# EAGLE schematic madaq_filter_panel_JAV (EAGLE 7.2.0)
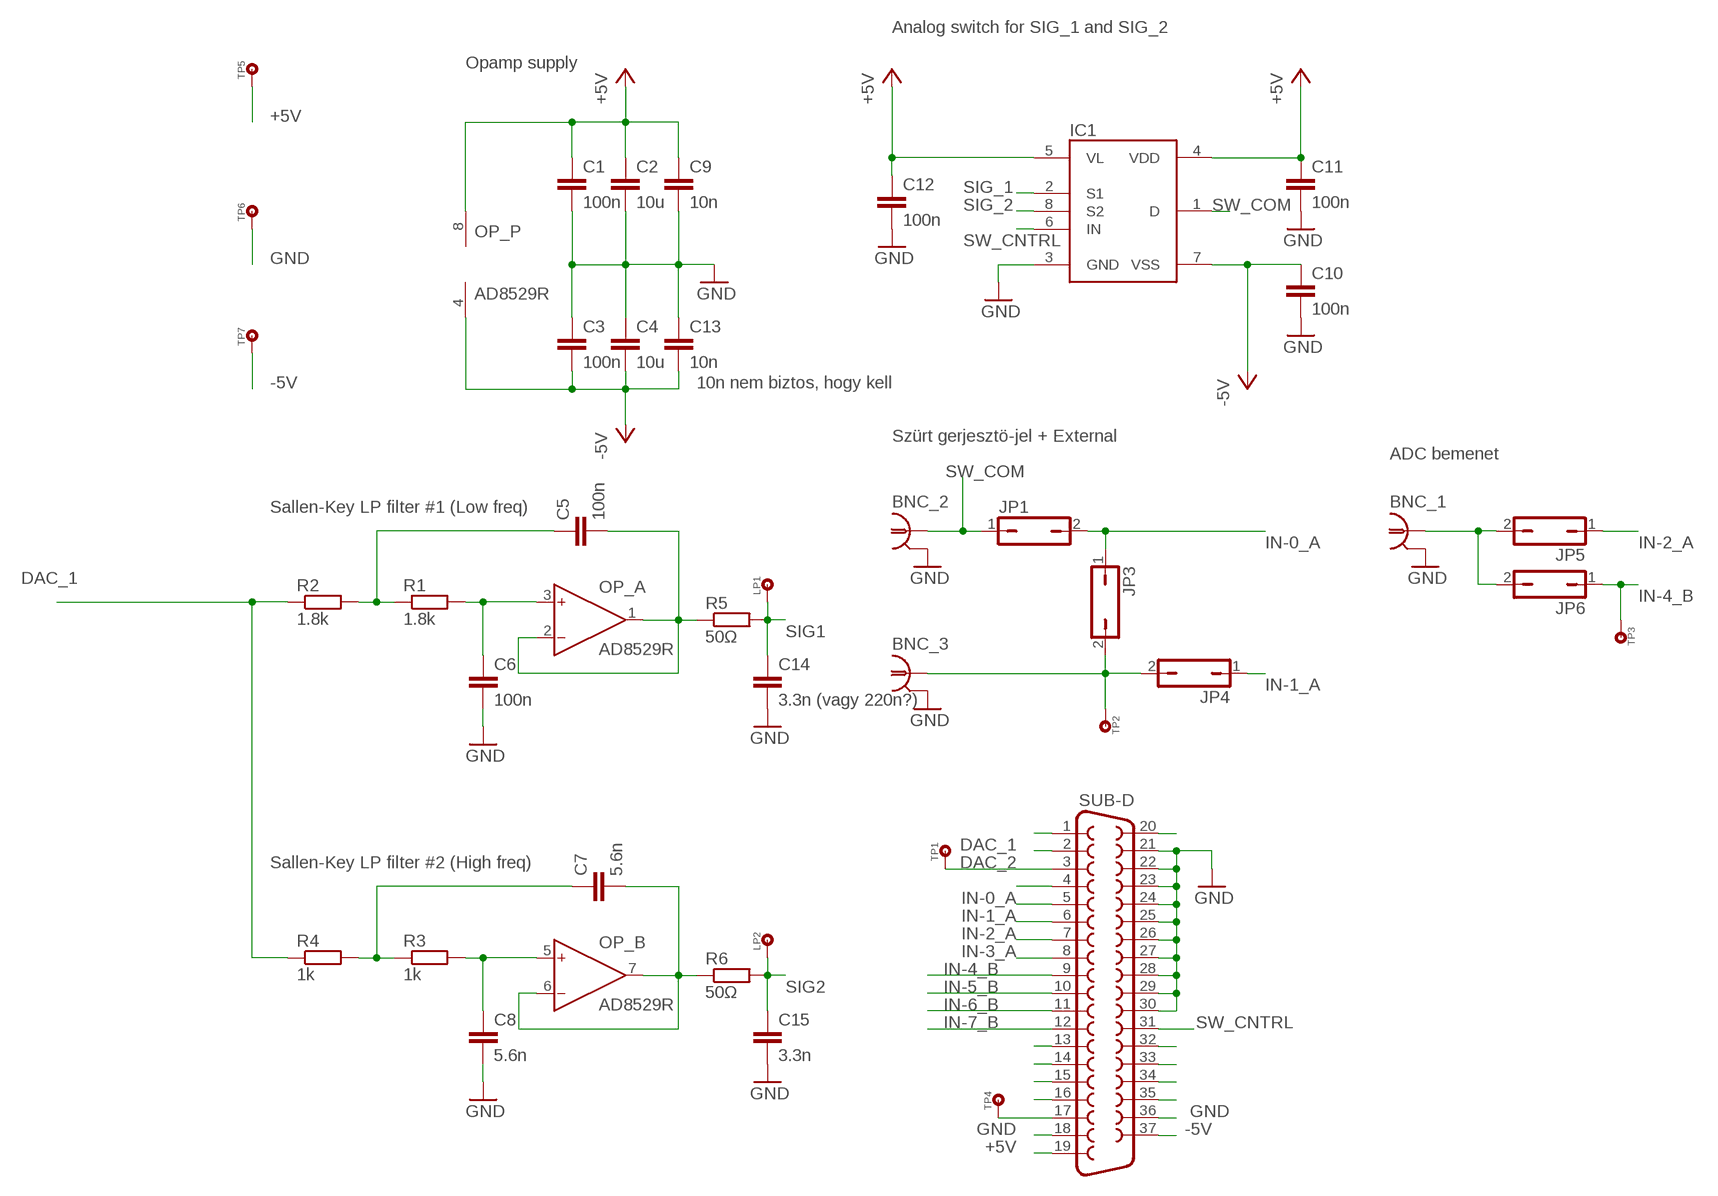
[diagram p0: schematic, sheet 1]

## Parts
BNC_1  BNC-ISOL-90I  [BNCPCB90I]
BNC_2  BNC-ISOL-90I  [BNCPCB90I]
BNC_3  BNC-ISOL-90I  [BNCPCB90I]
C1  100n  C1206  [C1206]
C2  10u  C1206  [C1206]
C3  100n  C1206  [C1206]
C4  10u  C1206  [C1206]
C5  100n  C1206  [C1206]
C6  100n  C1206  [C1206]
C7  5.6n  C1206  [C1206]
C8  5.6n  C1206  [C1206]
C9  10n  C1206  [C1206]
C10  100n  C1206  [C1206]
C11  100n  C1206  [C1206]
C12  100n  C1206  [C1206]
C13  10n  C1206  [C1206]
C14  3.3n (vagy 220n?)  C1206  [C1206]
C15  3.3n  C1206  [C1206]
IC1  ADG419BR  [SO08]
JP1  JP1Q  [JP1]
JP3  JP1Q  [JP1]
JP4  JP1Q  [JP1]
JP5  JP1Q  [JP1]
JP6  JP1Q  [JP1]
LP1  TP  [JP1]
LP2  TP  [JP1]
OP_  AD8529R  [SO8]
R1  1.8k  R1206  [R1206]
R2  1.8k  R1206  [R1206]
R3  1k  R1206  [R1206]
R4  1k  R1206  [R1206]
R5  50Ω  R1206  [R1206]
R6  50Ω  R1206  [R1206]
SUB-D  F37HP  [F37HP]
TP1  TP  [JP1]
TP2  TP  [JP1]
TP3  TP  [JP1]
TP4  TP  [JP1]
TP5  TP  [JP1]
TP6  TP  [JP1]
TP7  TP  [JP1]

## Nets
+5V: C1.2 C2.2 C9.2 C11.2 C12.2 IC1.4(VDD) IC1.5(VL) OP_.8(P:V+) SUB-D.19 TP5.1
-5V: C3.1 C4.1 C10.2 C13.1 IC1.7(VSS) OP_.4(P:V-) SUB-D.37 TP7.1
DAC_1: R2.1 R4.1 SUB-D.2
DAC_2: SUB-D.3 TP1.1
GND: BNC_1.SHIELD BNC_2.SHIELD BNC_3.SHIELD C1.1 C2.1 C3.2 C4.2 C6.1 C8.1 C9.1 C10.1 C11.1 C12.1 C13.2 C14.1 C15.1 IC1.3(GND) SUB-D.18 SUB-D.21 SUB-D.22 SUB-D.23 SUB-D.24 SUB-D.25 SUB-D.26 SUB-D.27 SUB-D.28 SUB-D.29 SUB-D.30 SUB-D.36 TP6.1
IN-0_A: JP1.2 JP3.1 SUB-D.5
IN-1_A: JP4.1 SUB-D.6
IN-2_A: JP5.1 SUB-D.7
IN-3_A: SUB-D.8
IN-4_B: JP6.1 SUB-D.9 TP3.1
IN-5_B: SUB-D.10
IN-6_B: SUB-D.11
IN-7_B: SUB-D.12
N$1: C7.2 R3.1 R4.2
N$2: C5.1 OP_.1(A:OUT) OP_.2(A:IN-) R5.1
N$3: C8.2 OP_.5(B:IN+) R3.2
N$4: C5.2 R1.1 R2.2
N$5: C6.2 OP_.3(A:IN+) R1.2
N$6: C7.1 OP_.6(B:IN-) OP_.7(B:OUT) R6.1
N$8: BNC_1.SIGNAL JP5.2 JP6.2
N$9: BNC_3.SIGNAL JP3.2 JP4.2 TP2.1
N$10: SUB-D.1
N$13: SUB-D.4
N$22: SUB-D.13
N$23: SUB-D.14
N$24: SUB-D.15
N$25: SUB-D.16
N$26: SUB-D.17 TP4.1
N$29: SUB-D.20
N$41: SUB-D.32
N$42: SUB-D.33
N$43: SUB-D.34
N$44: SUB-D.35
SIG1: C14.2 LP1.1 R5.2
SIG2: C15.2 LP2.1 R6.2
SIG_1: IC1.2(S1)
SIG_2: IC1.8(S2)
SW_CNTRL: IC1.6(IN) SUB-D.31
SW_COM: BNC_2.SIGNAL IC1.1(D) JP1.1

## Notes on the sheet
- Analog switch for SIG_1 and SIG_2
- Opamp supply
- 10n nem biztos, hogy kell
- Szürt gerjesztö-jel + External
- ADC bemenet
- Sallen-Key LP filter #1 (Low freq)
- Sallen-Key LP filter #2 (High freq)

## Library data of the parts
BNC_1-BNC_3 = Zoli2_2015-01-28:BNC-ISOL: Isolated BNC connector
C1-C15 = Zoli2_2015-01-28:C: Capacitor
IC1 = MRobi:ADG419
JP1 JP3-JP6 = jumper:JP1Q: JUMPER
LP1 LP2 TP1-TP7 = MRobi:TP: Test Pin
OP_ = analog-devices:AD8529: 8 MHz Rail-to-Rail Operational Amplifiers Source: http://www.analog.com/static/imported-files/data_sheets/AD8519_8529.pdf; MF: ALTERA CORPORATION; MPN: AD8529ARZ; OC_FARNELL: unknown; OC_NEWARK: 59K6807
R1-R6 = Zoli2_2015-01-28:R: Resistor
SUB-D = con-subd:F37: SUB-D; OC_FARNELL: unknown; OC_NEWARK: unknown